# Altium schematic sheet NTC.SchDoc
size 420 x 297 mm; SheetNumber: 16; SheetTotal: 21
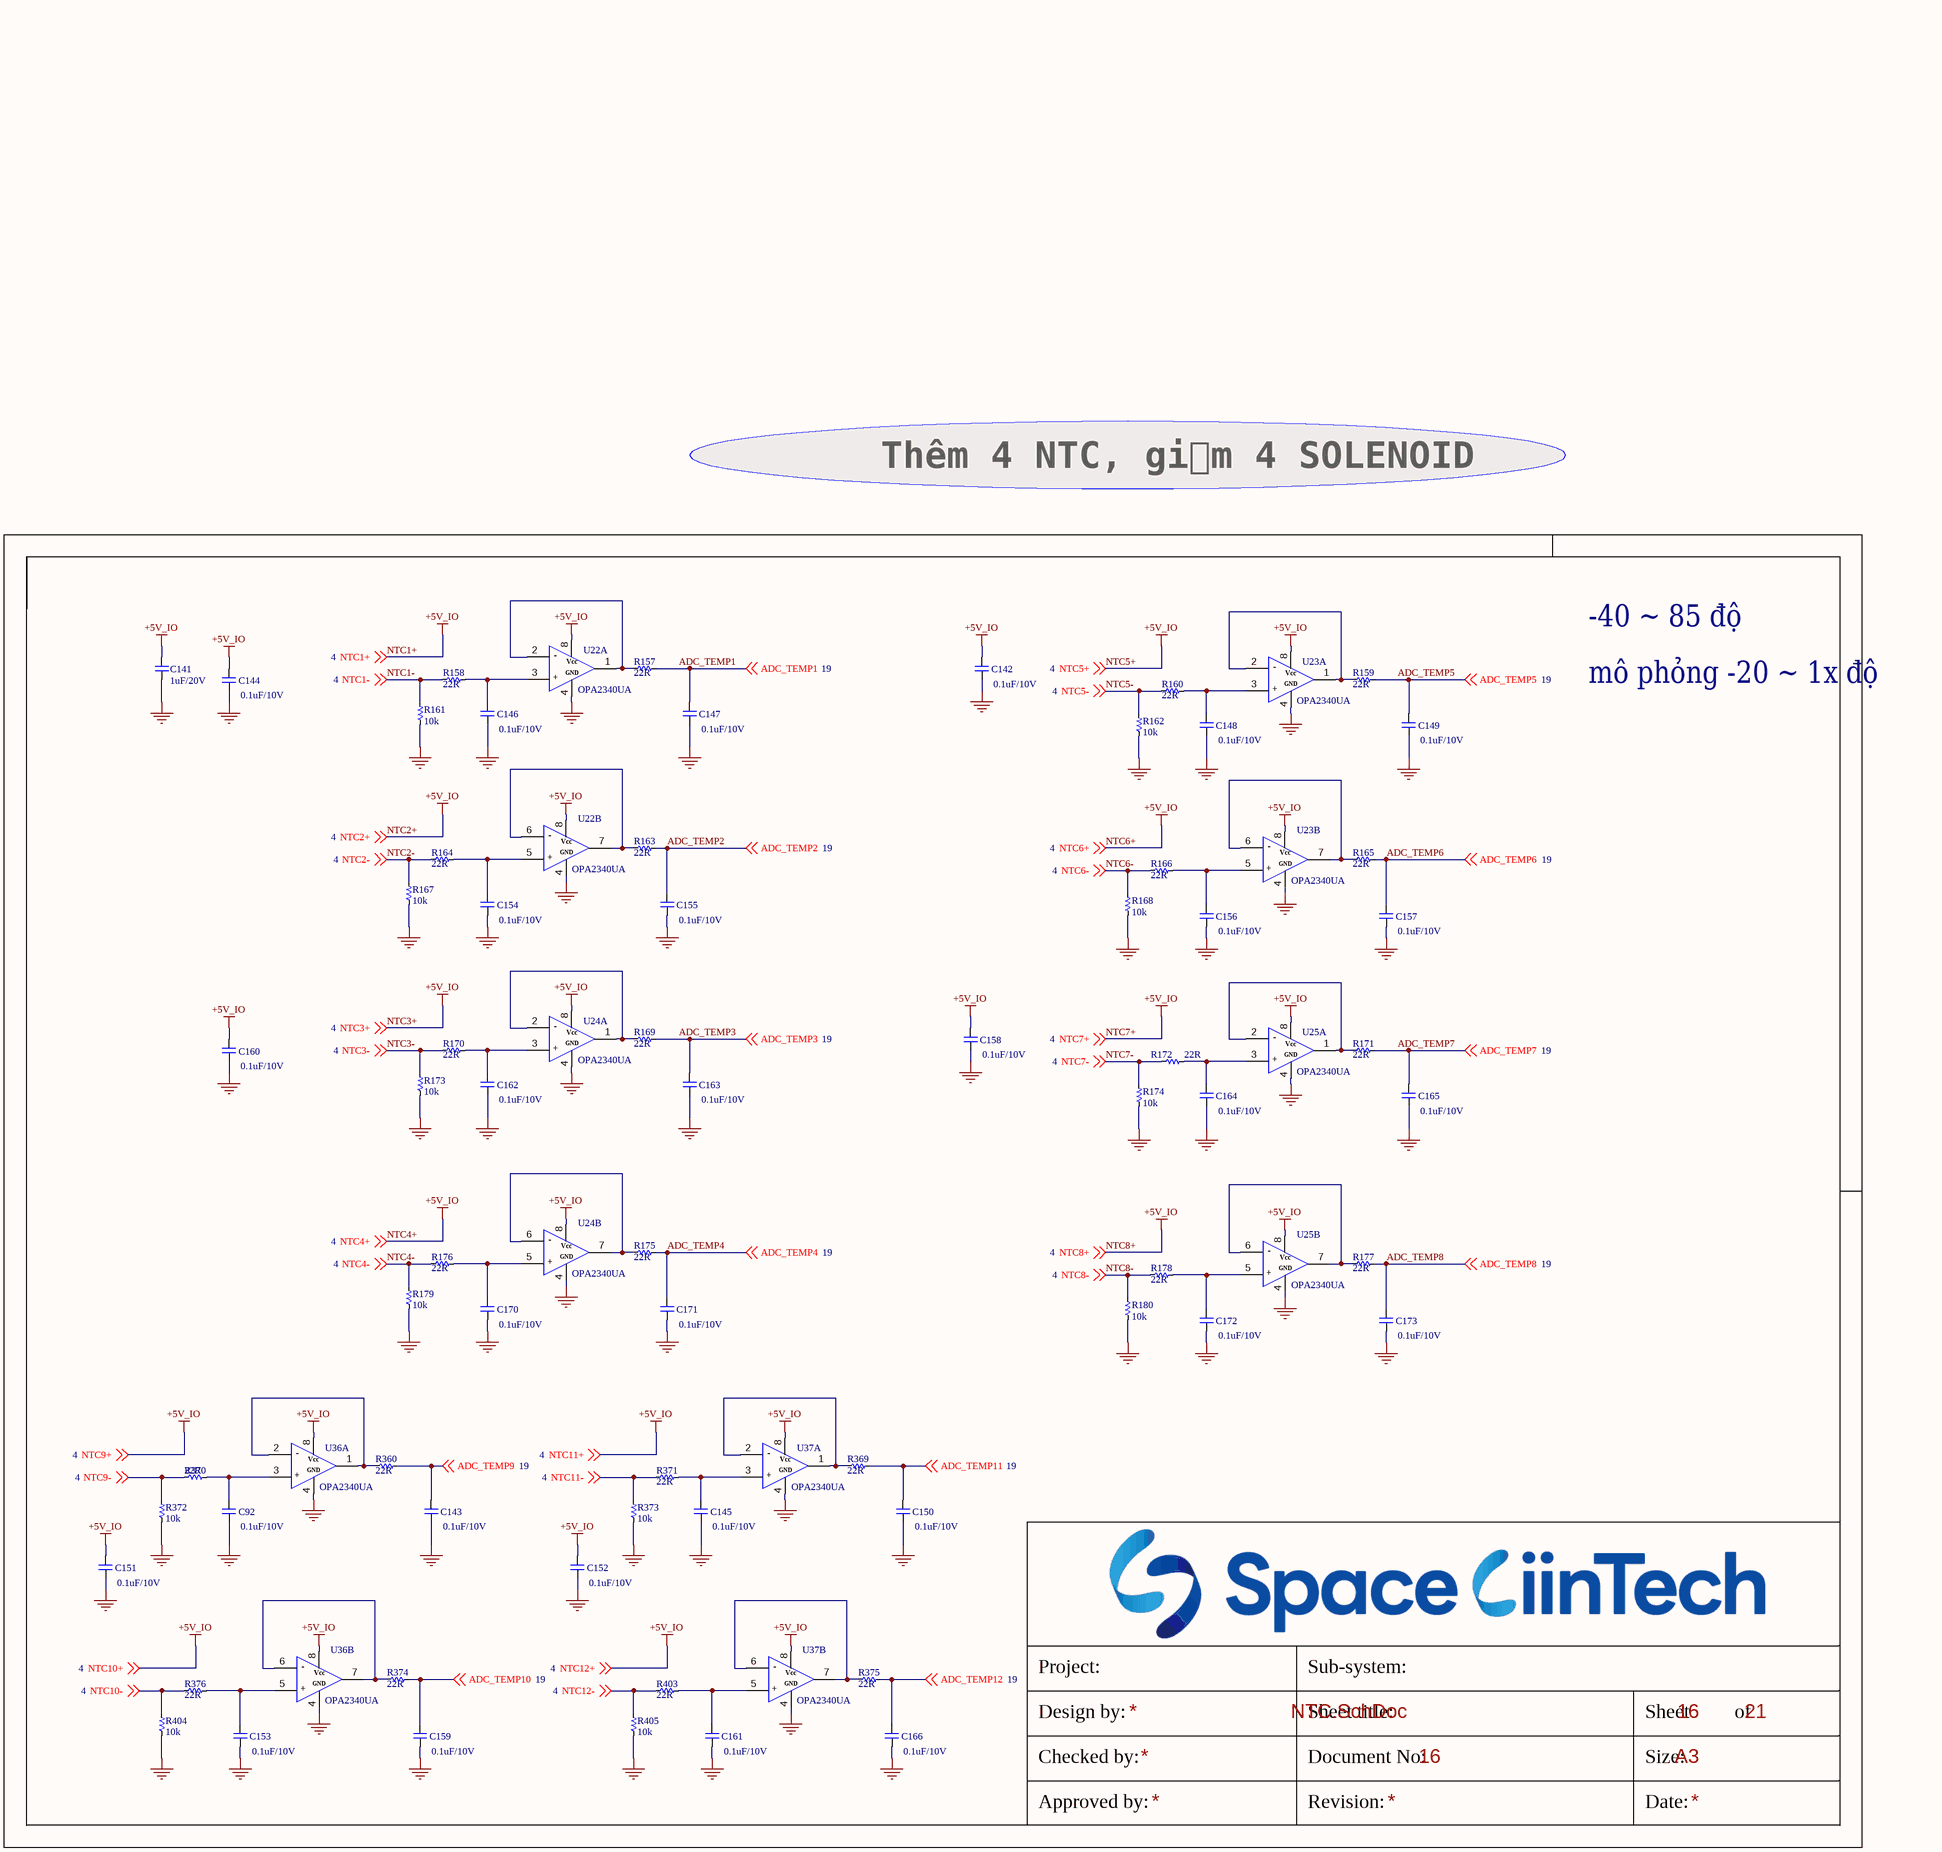
[diagram p0: NTC.SchDoc]

## Parts
C92  0.1uF/10V  [CAP_C_1005X60]
C141  1uF/20V  [CAP_C_1005X60]
C142  0.1uF/10V  [CAP_C_1005X60]
C143  0.1uF/10V  [CAP_C_1005X60]
C144  0.1uF/10V  [CAP_C_1005X60]
C145  0.1uF/10V  [CAP_C_1005X60]
C146  0.1uF/10V  [CAP_C_1005X60]
C147  0.1uF/10V  [CAP_C_1005X60]
C148  0.1uF/10V  [CAP_C_1005X60]
C149  0.1uF/10V  [CAP_C_1005X60]
C150  0.1uF/10V  [CAP_C_1005X60]
C151  0.1uF/10V  [CAP_C_1005X60]
C152  0.1uF/10V  [CAP_C_1005X60]
C153  0.1uF/10V  [CAP_C_1005X60]
C154  0.1uF/10V  [CAP_C_1005X60]
C155  0.1uF/10V  [CAP_C_1005X60]
C156  0.1uF/10V  [CAP_C_1005X60]
C157  0.1uF/10V  [CAP_C_1005X60]
C158  0.1uF/10V  [CAP_C_1005X60]
C159  0.1uF/10V  [CAP_C_1005X60]
C160  0.1uF/10V  [CAP_C_1005X60]
C161  0.1uF/10V  [CAP_C_1005X60]
C162  0.1uF/10V  [CAP_C_1005X60]
C163  0.1uF/10V  [CAP_C_1005X60]
C164  0.1uF/10V  [CAP_C_1005X60]
C165  0.1uF/10V  [CAP_C_1005X60]
C166  0.1uF/10V  [CAP_C_1005X60]
C170  0.1uF/10V  [CAP_C_1005X60]
C171  0.1uF/10V  [CAP_C_1005X60]
C172  0.1uF/10V  [CAP_C_1005X60]
C173  0.1uF/10V  [CAP_C_1005X60]
R157  22R  [RES_C_1005X40]
R158  22R  [RES_C_1005X40]
R159  22R  [RES_C_1005X40]
R160  22R  [RES_C_1005X40]
R161  10k  [RES_C_1005X40]
R162  10k  [RES_C_1005X40]
R163  22R  [RES_C_1005X40]
R164  22R  [RES_C_1005X40]
R165  22R  [RES_C_1005X40]
R166  22R  [RES_C_1005X40]
R167  10k  [RES_C_1005X40]
R168  10k  [RES_C_1005X40]
R169  22R  [RES_C_1005X40]
R170  22R  [RES_C_1005X40]
R171  22R  [RES_C_1005X40]
R172  22R  [RES_C_1005X40]
R173  10k  [RES_C_1005X40]
R174  10k  [RES_C_1005X40]
R175  22R  [RES_C_1005X40]
R176  22R  [RES_C_1005X40]
R177  22R  [RES_C_1005X40]
R178  22R  [RES_C_1005X40]
R179  10k  [RES_C_1005X40]
R180  10k  [RES_C_1005X40]
R360  22R  [RES_C_1005X40]
R369  22R  [RES_C_1005X40]
R370  22R  [RES_C_1005X40]
R371  22R  [RES_C_1005X40]
R372  10k  [RES_C_1005X40]
R373  10k  [RES_C_1005X40]
R374  22R  [RES_C_1005X40]
R375  22R  [RES_C_1005X40]
R376  22R  [RES_C_1005X40]
R403  22R  [RES_C_1005X40]
R404  10k  [RES_C_1005X40]
R405  10k  [RES_C_1005X40]
U22  OPA2340UA  [SOIC127P602X173-8N]  (parts A,B of 2)
U23  OPA2340UA  [SOIC127P602X173-8N]  (parts A,B of 2)
U24  OPA2340UA  [SOIC127P602X173-8N]  (parts A,B of 2)
U25  OPA2340UA  [SOIC127P602X173-8N]  (parts A,B of 2)
U36  OPA2340UA  [SOIC127P602X173-8N]  (parts A,B of 2)
U37  OPA2340UA  [SOIC127P602X173-8N]  (parts A,B of 2)

## Nets
GND: C92.1 C141.1 C142.1 C143.1 C144.1 C145.1 C146.1 C147.1 C148.1 C149.1 C150.1 C151.1 C152.1 C153.1 C154.1 C155.1 C156.1 C157.1 C158.1 C159.1 C160.1 C161.1 C162.1 C163.1 C164.1 C165.1 C166.1 C170.1 C171.1 C172.1 C173.1 R161.1 R162.1 R167.1 R168.1 R173.1 R174.1 R179.1 R180.1 R372.1 R373.1 R404.1 R405.1 U22.4 U23.4 U24.4 U25.4 U36.4 U37.4
NTC1+: C141.2 C142.2 C144.2 C151.2 C152.2 C158.2 C160.2 U22.8 U23.8 U24.8 U25.8 U36.8 U37.8 ; off-sheet NTC1+, off-sheet NTC2+, off-sheet NTC3+, off-sheet NTC4+, off-sheet NTC5+, off-sheet NTC6+, off-sheet NTC7+, off-sheet NTC8+, off-sheet NTC9+, off-sheet NTC10+, off-sheet NTC11+, off-sheet NTC12+  [also labelled +5V_IO, NTC10+, NTC11+, NTC12+, NTC2+, NTC3+, NTC4+, NTC5+, NTC6+, NTC7+, NTC8+, NTC9+]
ADC_TEMP1: C147.2 R157.2 ; off-sheet ADC_TEMP1
ADC_TEMP2: C155.2 R163.2 ; off-sheet ADC_TEMP2
ADC_TEMP3: C163.2 R169.2 ; off-sheet ADC_TEMP3
ADC_TEMP4: C171.2 R175.2 ; off-sheet ADC_TEMP4
ADC_TEMP5: C149.2 R159.2 ; off-sheet ADC_TEMP5
ADC_TEMP6: C157.2 R165.2 ; off-sheet ADC_TEMP6
ADC_TEMP7: C165.2 R171.2 ; off-sheet ADC_TEMP7
ADC_TEMP8: C173.2 R177.2 ; off-sheet ADC_TEMP8
ADC_TEMP9: C143.2 R360.2 ; off-sheet ADC_TEMP9
ADC_TEMP10: C159.2 R374.2 ; off-sheet ADC_TEMP10
ADC_TEMP11: C150.2 R369.2 ; off-sheet ADC_TEMP11
ADC_TEMP12: C166.2 R375.2 ; off-sheet ADC_TEMP12
NTC1-: R158.1 R161.2 ; off-sheet NTC1-
NTC2-: R164.1 R167.2 ; off-sheet NTC2-
NTC3-: R170.1 R173.2 ; off-sheet NTC3-
NTC4-: R176.1 R179.2 ; off-sheet NTC4-
NTC5-: R160.1 R162.2 ; off-sheet NTC5-
NTC6-: R166.1 R168.2 ; off-sheet NTC6-
NTC7-: R172.1 R174.2 ; off-sheet NTC7-
NTC8-: R178.1 R180.2 ; off-sheet NTC8-
NTC9-: R370.1 R372.2 ; off-sheet NTC9-
NTC10-: R376.1 R404.2 ; off-sheet NTC10-
NTC11-: R371.1 R373.2 ; off-sheet NTC11-
NTC12-: R403.1 R405.2 ; off-sheet NTC12-
NetC92_2: C92.2 R370.2 U36.3
NetC145_2: C145.2 R371.2 U37.3
NetC146_2: C146.2 R158.2 U22.3
NetC148_2: C148.2 R160.2 U23.3
NetC153_2: C153.2 R376.2 U36.5
NetC154_2: C154.2 R164.2 U22.5
NetC156_2: C156.2 R166.2 U23.5
NetC161_2: C161.2 R403.2 U37.5
NetC162_2: C162.2 R170.2 U24.3
NetC164_2: C164.2 R172.2 U25.3
NetC170_2: C170.2 R176.2 U24.5
NetC172_2: C172.2 R178.2 U25.5
NetR157_1: R157.1 U22.1 U22.2
NetR159_1: R159.1 U23.1 U23.2
NetR163_1: R163.1 U22.6 U22.7
NetR165_1: R165.1 U23.6 U23.7
NetR169_1: R169.1 U24.1 U24.2
NetR171_1: R171.1 U25.1 U25.2
NetR175_1: R175.1 U24.6 U24.7
NetR177_1: R177.1 U25.6 U25.7
NetR360_1: R360.1 U36.1 U36.2
NetR369_1: R369.1 U37.1 U37.2
NetR374_1: R374.1 U36.6 U36.7
NetR375_1: R375.1 U37.6 U37.7

## Notes on the sheet
- Thêm 4 NTC, giảm 4 SOLENOID
- -40 ~ 85 độ
- mô phỏng -20 ~ 1x độ
- Project:
- Sub-system:
- Design by:
- Sheet title:
- Sheet
- of
- Checked by:
- Approved by:
- Revision:
- Document No:
- Size:
- Date:
- A3
- (in symbol OPA2340UA, part A) -; Vcc; GND; +
- (in symbol OPA2340UA, part B) -; Vcc; GND; +

## Library data of the parts
C92 C141-C166 C170-C173 = _CAP_C_2: CAP CHIP
R157-R180 R360 R369-R376 R403-R405 = _RES_B_2: RES